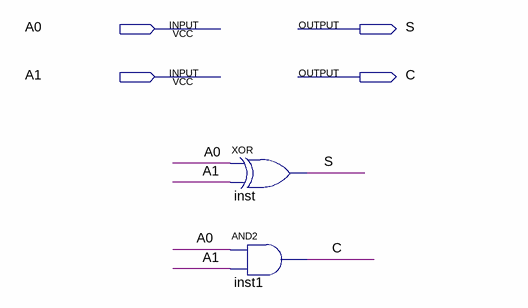
[diagram p0: schematic sheet]
// Quartus schematic half_adder_jin_s.bdf as structural Verilog: 2 symbols, 4 pins
module half_adder_jin_s (
  input  A0,
  input  A1,
  output S,
  output C
);

  xor inst (S, A0, A1);
  and inst1 (C, A0, A1);
endmodule
